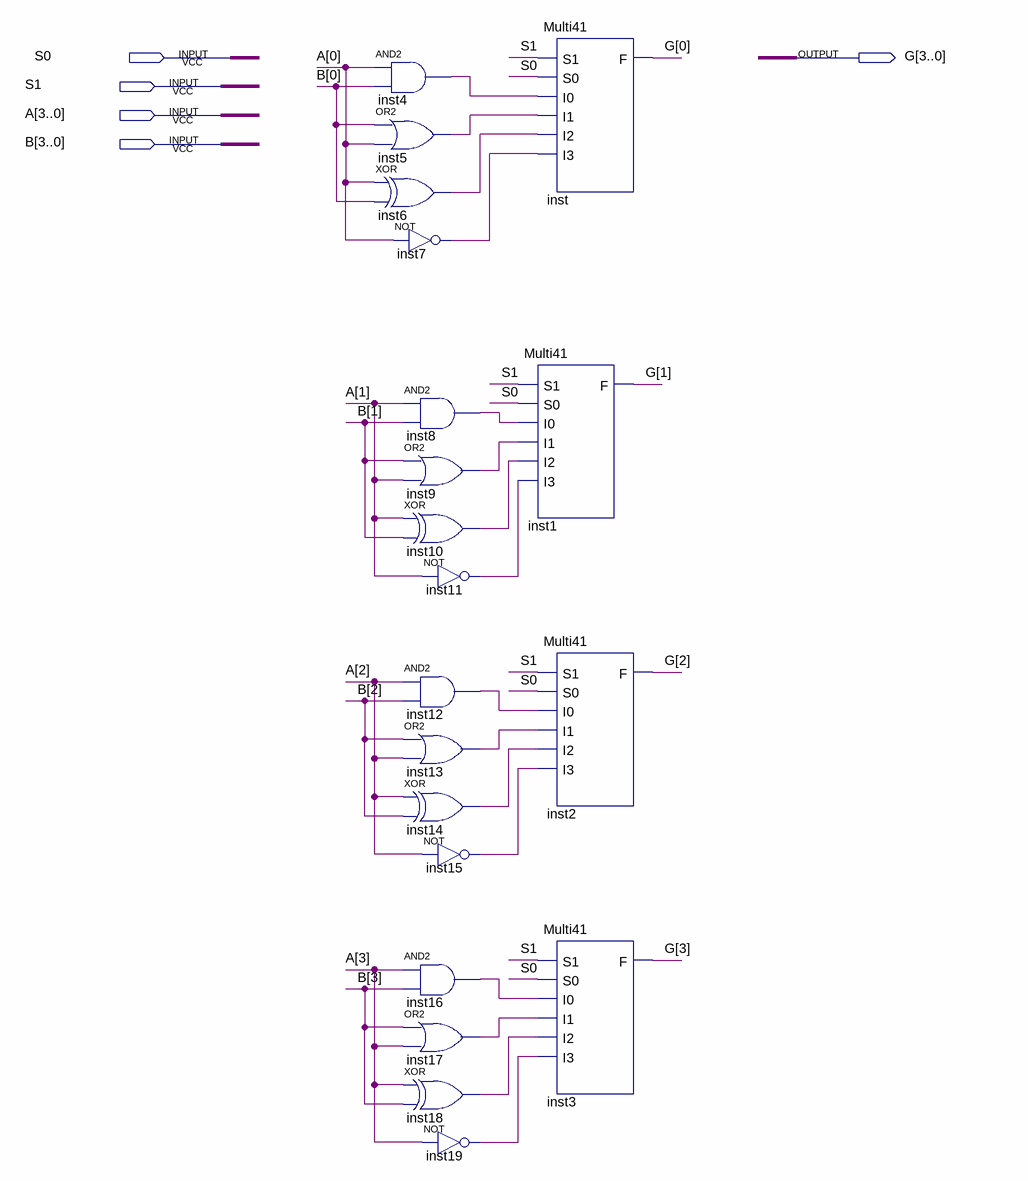
[diagram p0: schematic sheet]
// Quartus schematic LU.bdf as structural Verilog: 20 symbols, 5 pins
module LU (
  input  S0,
  input  S1,
  input  [3:0] A,
  input  [3:0] B,
  output [3:0] G
);

  wire inst4_out, inst5_out, inst6_out, inst7_out, inst8_out, inst9_out, inst10_out, inst11_out, inst12_out,
       inst13_out, inst14_out, inst15_out, inst16_out, inst17_out, inst18_out, inst19_out;

  and inst4 (inst4_out, A[0], B[0]);
  or inst5 (inst5_out, B[0], A[0]);
  xor inst6 (inst6_out, A[0], B[0]);
  not inst7 (inst7_out, A[0]);
  and inst8 (inst8_out, A[1], B[1]);
  or inst9 (inst9_out, B[1], A[1]);
  xor inst10 (inst10_out, A[1], B[1]);
  not inst11 (inst11_out, A[1]);
  and inst12 (inst12_out, A[2], B[2]);
  or inst13 (inst13_out, B[2], A[2]);
  xor inst14 (inst14_out, A[2], B[2]);
  not inst15 (inst15_out, A[2]);
  and inst16 (inst16_out, A[3], B[3]);
  or inst17 (inst17_out, B[3], A[3]);
  xor inst18 (inst18_out, A[3], B[3]);
  not inst19 (inst19_out, A[3]);
  Multi41 inst (.S1(S1), .S0(S0), .I0(inst4_out), .I1(inst5_out), .I2(inst6_out), .I3(inst7_out), .F(G[0]));
  Multi41 inst1 (.S1(S1), .S0(S0), .I0(inst8_out), .I1(inst9_out), .I2(inst10_out), .I3(inst11_out), .F(G[1]));
  Multi41 inst2 (.S1(S1), .S0(S0), .I0(inst12_out), .I1(inst13_out), .I2(inst14_out), .I3(inst15_out), .F(G[2]));
  Multi41 inst3 (.S1(S1), .S0(S0), .I0(inst16_out), .I1(inst17_out), .I2(inst18_out), .I3(inst19_out), .F(G[3]));
endmodule
